# Altium schematic sheet MP1584_5V.SchDoc
size A
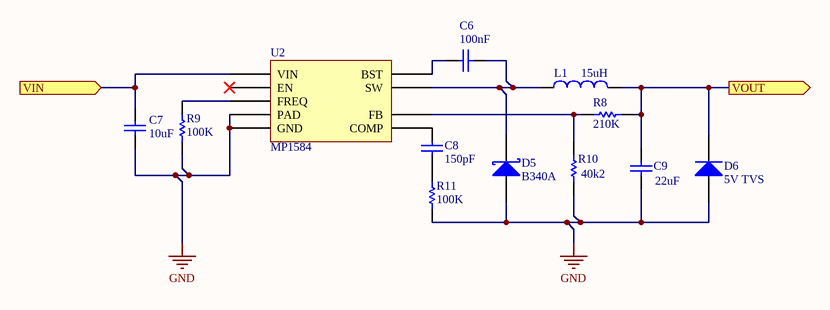
[diagram p0: MP1584_5V.SchDoc]

## Parts
C6  100nF  [CAPC0603(1608)100_L]
C7  10uF  [CAPC1210(3225)280_L]
C8  150pF  [CAPC0603(1608)100_L]
C9  22uF  [CAPC1210(3225)170_L]
D5  B340A  [DIOD-SMA-2_V]
D6  5V TVS  [VISH-DO-214AC-2_L]
L1  value 15uH  [0630 Inductor]  (hidden comment: 0630 Inductor)
R8  210K  [RESC0603(1608)_L]
R9  100K  [RESC0603(1608)_L]
R10  40k2  [RESC0603(1608)_L]
R11  100K  [RESC0603(1608)_L]
U2  MP1584  [SOIC8E]

## Ports
VIN (in), VOUT (out)

## Nets
GND: C7.1 C9.1 D5.1(A) D6.2(A) R9.1 R10.1 R11.1 U2.5(GND) U2.9(PAD)
VIN: C7.2 U2.7(VIN) ; port VIN
VOUT: C9.2 D6.1(K) L1.2 R8.2 ; port VOUT
NetC6_1: C6.1 U2.8(BST)
NetC6_2: C6.2 D5.2(K) L1.1 U2.1(SW)
NetC8_1: C8.1 R11.2
NetC8_2: C8.2 U2.3(COMP)
NetR8_1: R8.1 R10.2 U2.4(FB)
NetR9_2: R9.2 U2.6(FREQ)

Not connected (* = marked no-connect by the designer): U2 2(EN)*

## Library data of the parts
C6 = CMP-1035-02591-1: CAP 100nF 50V ±5% 0603 (1608 Metric) Thickness 1mm SMD; Tolerance: Â±5%; Case-Metric: 1608; Case-EIA: 0603; Rated Voltage: 50 V; Max Thickness: 1 mm; Technology: SMT; Value: 100nF
C7 = CMP-1038-02234-1: CAP 10uF 35V ±10% 1210 (3225 Metric) Thickness 2.8mm SMD; Case-Metric: 3225; Case-EIA: 1210; Tolerance: Â±10%; Rated Voltage: 35 V; Value: 10uF; Max Thickness: 2.8 mm; Technology: SMT
C8 = CMP-1035-01367-1: CAP 150pF 50V ±5% 0603 (1608 Metric) Thickness 1mm SMD; Case-Metric: 1608; Tolerance: Â±5%; Case-EIA: 0603; Technology: SMT; Rated Voltage: 50 V; Value: 150pF; Max Thickness: 1 mm
C9 = CMP-1038-02258-1: CAP 22uF 6.3V ±10% 1210 (3225 Metric) Thickness 1.7mm SMD; Case-Metric: 3225; Tolerance: Â±10%; Case-EIA: 1210; Value: 22uF; Rated Voltage: 6.3 V; Technology: SMT; Max Thickness: 1.7 mm
D5 = CMP-1667-00003-1: Surface Mount Schottky Barrier Rectifier, 40 V, 3 A, -55 to 150 degC, 2-Pin SMA, RoHS, Tape and Reel; Forward Current: 3 A; Forward Voltage: 500 mV; Max Surge Current: 80 A; Peak Reverse Current: 500 uA; Elements: 1; Mounting Technology: Surface Mount; ComponentLink1URL: http://www.diodes.com/; PackageDescription: 2-Pin Surface Mounted Assembly, Body 4.3 x 2.605 mm, Height 2.4 mm; Min Operating Temperature: -55 degC; Mount: Surface Mount; Pins: 2; ComponentLink2URL: http://www.diodes.com/_files/datasheets/ds30891.pdf; PackageReference: SMA-2; Max Operating Temperature: 125 degC; Radiation Hardening: No; Length: 4.6 mm; RoHSCompliant: true; ComponentLink1Description: Manufacturer URL; Height: 2.1 mm; ComponentLink2Description: Datasheet; Packaging: Tape and Reel; Package Quantity: 5000; Case\Package: SMA; DatasheetVersion: Rev. 17 - 2, 09/2015; REACH SVHC: No SVHC; Width: 2.92 mm
D6 = CMP-0548-00062-2: Transient Voltage Suppressor, 6.40 to 231 V, 5 V Stand-off Voltage, Uni-Directional, -55 to 155 degC, 2-pin DO-214AC, Pb-Free, Tape and Reel; Manufacturer: Vishay Semiconductor; PartNumber: SMAJ5.0AHE3/61; ID (uA): 800; VBR Uni-Directional (V): 6.4 to 231; IFSM: 40 A; VWM (V): 5; PPPM (W): 400, 300; DatasheetVersion: 12/8/2013; ComponentLink3URL: http://www.vishay.com/docs/88390/smaj50a.pdf; ComponentLink2URL: http://www.vishay.com/docs/88390/smaj50a.pdf; PackageDescription: 2-Pin DO-214AC (SMA), Body 4.245 x 2.665 mm; ComponentLink3Description: Package Specification; RoHS: TRUE; Operating Junction and Storage Temperature Range: -55 to 150 degC; ComponentLink2Description: Datasheet; Mounting Technology: Surface Mount; Packing: Tape and Reel; PackageReference: DO-214AC-2; ComponentLink1Description: Manufacturer URL; ComponentLink1URL: http://www.vishay.com/
L1 = PCC-M0630M: Code_IEC: 1005; Published: 8-Jun-2000; LatestRevisionDate: 29-May-2009; LatestRevisionNote: IPC-7351 Footprint Added.; PackageReference: 0402-A; Publisher: Altium Limited; PackageDescription: Chip Inductor; Code_JEITA: 0402
R8 = CMP-1012-00770-1: 210K 0.1W 1% 0603 (1608 Metric)  SMD; Case-Metric: 1608; Value: 210000.00 Ohm; Case-EIA: 0603; Technology: SMT; Power: 0.1 W; Tolerance: 1 %
R9 R11 = CMP-1012-00122-1: 100K 0.1W 5% 0603 (1608 Metric)  SMD; Case-EIA: 0603; Value: 100000.00 Ohm; Case-Metric: 1608; Tolerance: 5 %; Power: 0.1 W; Technology: SMT
R10 = CMP-1012-00691-1: 40K2 0.1W 1% 0603 (1608 Metric)  SMD; Case-Metric: 1608; Value: 40200.00 Ohm; Case-EIA: 0603; Tolerance: 1 %; Technology: SMT; Power: 0.1 W
U2 = MP1584: MP1584 3A, 1.5MHz, 28V Step-Down Converter